# EAGLE design DCDC1 (EAGLE 7.2.0)
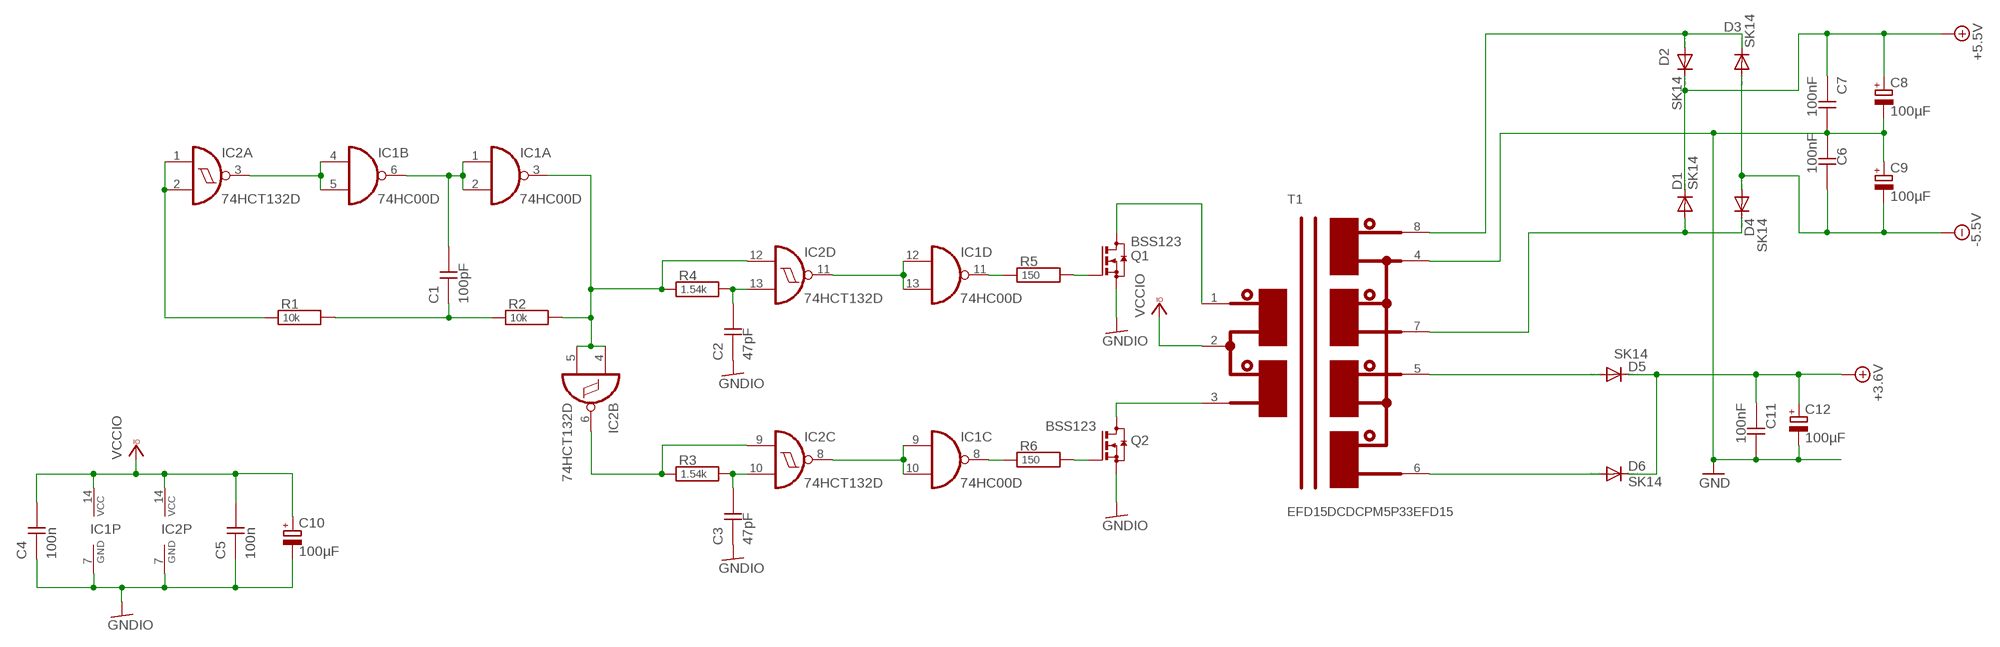
[diagram p0: schematic, sheet 1]

## Parts
C1  100pF  C0603  [0603]
C2  47pF  C0603  [0603]
C3  47pF  C0603  [0603]
C4  100n  C0603  [0603]
C5  100n  C0603  [0603]
C6  100nF  C0603  [0603]
C7  100nF  C0603  [0603]
C8  100µF  CPOL-EUCT6032  [CT6032]
C9  100µF  CPOL-EUCT6032  [CT6032]
C10  100µF  CPOL-EUCT6032  [CT6032]
C11  100nF  C0603  [0603]
C12  100µF  CPOL-EUCT6032  [CT6032]
D1  SK14  DIODE-DO214AC  [DO214AC]
D2  SK14  DIODE-DO214AC  [DO214AC]
D3  SK14  DIODE-DO214AC  [DO214AC]
D4  SK14  DIODE-DO214AC  [DO214AC]
D5  SK14  DIODE-DO214AC  [DO214AC]
D6  SK14  DIODE-DO214AC  [DO214AC]
IC1  74HC00D  [SO14]
IC2  74HCT132D  [SO14]
Q1  BSS123  [SOT23]
Q2  BSS123  [SOT23]
R1  10k  R0603  [0603]
R2  10k  R0603  [0603]
R3  1.54k  R0603  [0603]
R4  1.54k  R0603  [0603]
R5  150  R0603  [0603]
R6  150  R0603  [0603]
T1  EFD15DCDCPM5P33EFD15  [B66414-W1008-D1]

## Nets
+3.6V: C11.1 C12.+ D5.C D6.C
+5.5V: C7.1 C8.+ D1.C D2.C
-5.5V: C6.2 C9.- D3.A D4.A
GND: C6.1 C7.2 C8.- C9.+ C11.2 C12.- T1.4(SM)
GNDIO: C2.1 C3.1 C4.1 C5.1 C10.- IC1.7(P:GND) IC2.7(P:GND) Q1.2(S) Q2.2(S)
N$1: IC2.1(A:I0) IC2.2(A:I1) R1.1
N$2: IC1.4(B:I0) IC1.5(B:I1) IC2.3(A:O)
N$3: C1.1 R1.2 R2.1
N$4: C1.2 IC1.1(A:I0) IC1.2(A:I1) IC1.6(B:O)
N$5: IC1.3(A:O) IC2.4(B:I0) IC2.5(B:I1) IC2.12(D:I0) R2.2 R4.1
N$6: IC1.12(D:I0) IC1.13(D:I1) IC2.11(D:O)
N$7: C2.2 IC2.13(D:I1) R4.2
N$8: IC2.6(B:O) IC2.9(C:I0) R3.1
N$9: C3.2 IC2.10(C:I1) R3.2
N$10: IC1.9(C:I0) IC1.10(C:I1) IC2.8(C:O)
N$11: IC1.11(D:O) R5.1
N$12: IC1.8(C:O) R6.1
N$13: Q2.1(G) R6.2
N$14: D5.A T1.5(S2P)
N$15: Q1.1(G) R5.2
N$16: Q1.3(D) T1.1(P1P)
N$17: D1.A D4.C T1.7(S1N)
N$20: D2.A D3.C T1.8(S1P)
N$21: Q2.3(D) T1.3(P1N)
N$24: D6.A T1.6(S2N)
VCCIO: C4.2 C5.2 C10.+ IC1.14(P:VCC) IC2.14(P:VCC) T1.2(P1M)

## Library data of the parts
C1-C7 C11 = teg2:C0603
C8-C10 C12 = rcl:CPOL-EU: POLARIZED CAPACITOR, European symbol
D1-D6 = diode:DIODE-: DIODE
IC1 = 74xx-eu:74*00: Quad 2-input NAND gate
IC2 = 74xx-eu:74*132: Quad 2-input NAND schmitt trigger
Q1 Q2 = transistor-small-signal:BSS123: N-CHANNEL MOS FET
R1-R6 = teg2:R0603
T1 = transformers:EFD15DCDCPM5P33

## Board
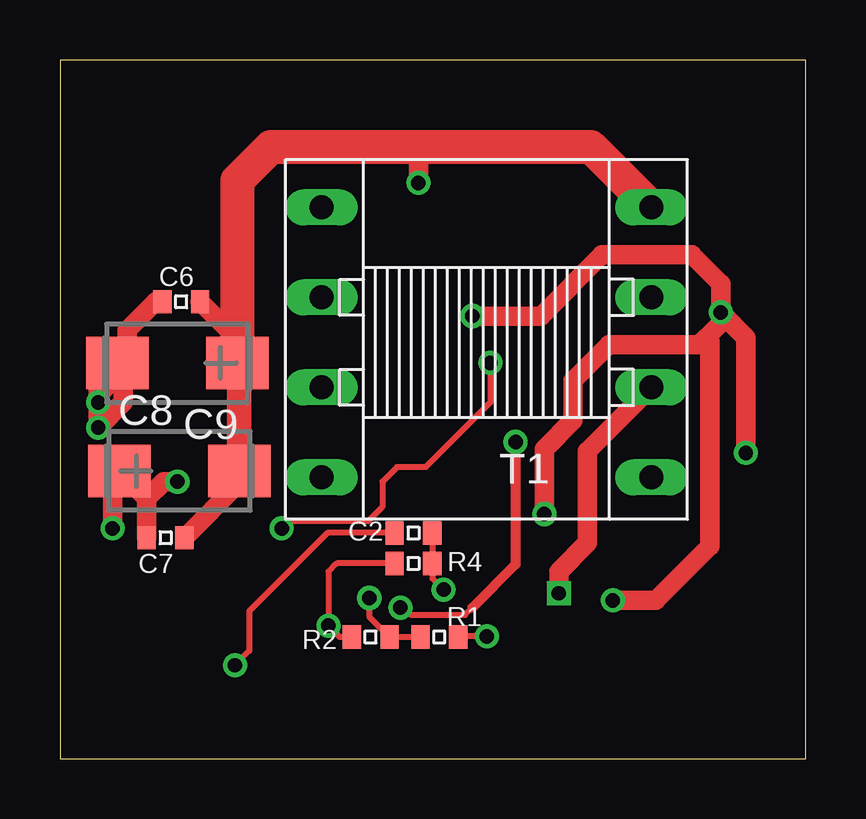
[diagram p1: board, top side]
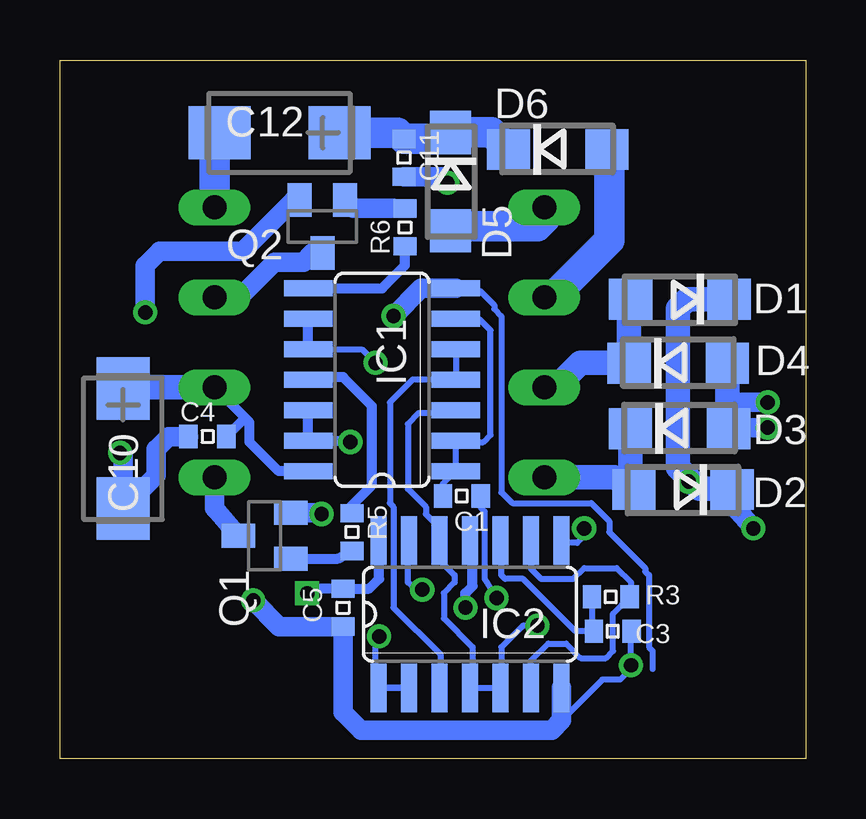
[diagram p2: board, bottom side, seen from below]

Size 31.1 x 29.11 mm. Coordinates in mm from the lower left corner, seen from the top.
Outline: 0,0 31.1,0 31.1,29.11 0,29.11 0,0
Copper layers (1*16): Top 0.035mm / dielectric 1.5mm / Bottom 0.035mm
Design rules "default *": minimum track width 10mil, minimum drill 0.3mm, track to track 6mil, track to pad 6mil, pad to pad 6mil, via to via 6mil, smd to smd 0mil, copper to edge 20mil, drill to drill 8mil, minimum pad ring 10mil, minimum via ring 8mil, stop-mask expansion 4mil, vias tented up to drill 0mil, thermal gap 10mil

### Footprints (pad centres in the part's own frame; a part is rotated, then mirrored left to right if it is on the bottom)
0603 = smd 0.762 x 0.965: 1 -0.787,0; 2 0.787,0
CT6032 = smd 2.6 x 2.2: + -2.5,0; - 2.5,0
DO214AC = smd 1.8 x 1.7: A 2.05,0; C -2.05,0
SO14 = smd 0.66 x 2.032: 1 -3.81,-3.073; 2 -2.54,-3.073; 3 -1.27,-3.073; 4 0,-3.073; 5 1.27,-3.073; 6 2.54,-3.073; 7 3.81,-3.073; 8 3.81,3.073; 9 2.54,3.073; 10 1.27,3.073; 11 0,3.073; 12 -1.27,3.073; 13 -2.54,3.073; 14 -3.81,3.073
SOT23 = smd 1 x 1.4: 1 -0.95,-1.1; 2 0.95,-1.1; 3 0,1.1
B66414-W1008-D1 = drill 1 long: 1 -3.75,0; 2 0,0; 3 3.75,0; 4 7.5,0; 5 7.5,13.75; 6 3.75,13.75; 7 0,13.75; 8 -3.75,13.75

### Placement (x,y rotation side)
C1  14.34,10.95 180 bottom
C2  14.74,9.4 0 top
C3  8.05,5.31 180 bottom
C4  24.95,13.42 0 bottom
C5  19.3,6.29 90 bottom
C6  5.06,19.04 180 top
C7  4.41,9.2 0 top
C8  4.98,11.99 0 top
C9  4.9,16.48 180 top
C10  28.47,12.93 270 bottom
C11  16.76,25.04 270 bottom
C12  21.94,26.08 180 bottom
D1  5.26,19.15 180 bottom
D2  5.13,11.22 180 bottom
D3  5.27,13.75 0 bottom
D4  5.33,16.48 0 bottom
D5  14.82,24.05 270 bottom
D6  10.35,25.38 0 bottom
IC1  17.67,15.79 90 bottom
IC2  14.01,6.02 0 bottom
Q1  22.57,9.29 90 bottom
Q2  20.16,22.18 180 bottom
R1  15.82,5.07 180 top
R2  12.96,5.07 180 top
R3  8.14,6.74 180 bottom
R4  14.74,8.13 0 top
R5  18.93,9.44 270 bottom
R6  16.72,22.14 90 bottom
T1  24.66,15.47 90 top

### Tracks (layer width: path | path; a pad name or v marks a point on that pad's centre or on a via)
+3.6V
  Bottom 1.27: C12.+ 17.02,26.08 C11.1 15.09,25.82 D5.C 13.11,26.09 D6.C
+5.5V  (via drill 0.6)
  Top 0.813: C7.1 3.62,10.85 | 3.62,10.85 C8.+ 2.2,11.7 v2.2,9.59 | v4.9,11.54 4.32,11.54 3.62,10.85
  Bottom 0.813: 3.1,11.24 3.1,10.65 v2.2,9.59
  Bottom 1.016: D1.C 4.94,19.15 5.35,18.74 5.35,12.14 4.45,11.24 3.1,11.24 D2.C
-5.5V  (via drill 0.6)
  Top 0.813: C6.2 3.99,19.04 2.8,17.84 2.8,17.39 2.65,17.24 2.65,16.2 | 2.65,16.2 1.6,15.14 v1.6,14.84 | 2.65,16.2 2.65,14.84 v1.6,13.8 v1.6,14.84 | v1.6,14.84 1.6,15.89 1.81,15.89 C9.-
  Bottom 0.813: v1.6,14.84 3.28,14.84 | v1.6,13.8 3.18,13.8 D3.A
  Bottom 1.016: D4.A 3.28,14.84 3.28,13.8 D3.A
GND  (via drill 0.6)
  Top 0.813: C9.+ 7.4,17.49 C6.1 | C8.- 7.48,11.49 C7.2 | v14.95,23.99 14.95,25.34 15.09,25.49
  Top 1.016: C8.- 7.48,16.41 C9.+
  Top 1.422: 7.4,17.49 7.4,24.1 8.8,25.49 15.09,25.49 22.14,25.49 T1.4
  Bottom 0.813: C11.2 15.2,24.25 v14.95,23.99
  Bottom 1.27: T1.4 24.66,25.87 C12.-
GNDIO  (via drill 0.6)
  Top 0.254: C2.1 11.16,9.4 7.9,6.14 7.9,4.49 v7.3,3.89
  Top 0.813: v20.2,10.2 20.2,12.89 21.4,14.09 21.4,15.74 22.9,17.24 26.65,17.24 26.95,17.55 | 26.95,17.55 27.55,18.14 v27.55,18.59 | v23.05,6.59 24.84,6.59 27.09,8.84 27.09,17.39 26.95,17.55 | v28.59,12.74 28.59,17.55 v27.55,18.59 | v17.2,18.45 20.05,18.45 22.59,20.99 26.34,20.99 27.55,19.8 v27.55,18.59
  Bottom 0.254: IC1.7 14.15,19.6 13.6,19.49 13,18.89 13,18.74 12.7,18.45 12.7,11.09 12.25,10.64 8.95,10.64 8.2,9.89 8.2,9.45 6.7,7.95 6.7,7.79 6.55,7.64 6.55,4.64 6.4,4.49 6.4,3.74 | C3.1 7.3,5.28 v7.3,3.89 7.3,3.74 7.75,3.29 8.5,3.29 10.6,1.2
  Bottom 0.813: C4.1 26.57,13.42 27.09,12.89 27.09,11.8 C10.- 28.47,12.62 v28.59,12.74 | Q1.2 20.24,10.24 v20.2,10.2 | Q2.2 21.36,23.28 23.5,21.14 26.95,21.14 27.55,20.55 v27.55,18.59 | IC2.7 10.2,1.59 10.6,1.2 18.55,1.2 19.3,1.95 C5.1 21.96,5.51 v23.05,6.59 | IC1.7 16.04,19.6 v17.2,18.45
N$1  (via drill 0.6)
  Top 0.254: v17.8,5.09 16.63,5.09 R1.1
  Bottom 0.254: IC2.1 IC2.2 17.6,2.95 17.95,3.29 17.95,4.95 v17.8,5.09
N$2
  Bottom 0.254: IC1.5 IC1.4 16.4,15.79 17.34,14.84 17.34,10.64 17.2,10.49 17.2,6.29 15.25,4.34 15.25,2.98 IC2.3
N$3  (via drill 0.6)
  Top 0.254: v12.9,6.7 12.9,5.91 R2.1 R1.2
  Bottom 0.254: C1.1 13.56,10.46 13.4,10.29 13.4,7.49 v12.9,6.7
N$4
  Bottom 0.254: IC1.6 14.56,18.3 13.6,18.3 13.15,17.84 13.15,13.49 13.45,13.2 14.54,13.2 IC1.2 IC1.1 15.13,11.45 C1.2
N$5  (via drill 0.6)
  Top 0.254: R2.2 11.67,5.07 v11.2,5.54 11.2,7.79 11.54,8.13 R4.1
  Bottom 0.254: 14.72,14.39 16.15,14.39 16.59,13.95 16.59,11.24 15.84,10.49 15.84,10.2 15.4,9.74 15.4,9.21 IC2.12 15.28,8.28 14.65,7.64 14.65,7.34 15.09,6.89 15.09,5.84 13.9,4.64 13.9,3.06 IC2.4 IC2.5 12.7,2.99 12.7,4.64 11.8,5.54 v11.2,5.54
  Bottom 0.406: 14.72,14.39 IC1.3
N$6  (via drill 0.6)
  Top 0.254: v14.2,6.29 14.34,6.29 14.65,5.99 16.9,5.99 17.2,6.29
  Top 0.406: v19,13.2 19,8.09 17.2,6.29
  Bottom 0.406: IC1.12 IC1.13 19.05,13.25 v19,13.2 | v14.2,6.29 14.2,6.89 13.9,7.2 13.9,8.98 IC2.11
N$7  (via drill 0.6)
  Top 0.254: C2.2 R4.2 15.52,7.52 v16,7.04
  Bottom 0.254: v16,7.04 16.3,7.04 16.59,7.34 16.59,9.05 IC2.13
N$8
  Bottom 0.254: IC2.9 11.47,7.92 11.05,7.49 9.7,7.49 9.25,7.95 7.9,7.95 7.3,7.34 7.3,6.8 R3.1 8.05,6.05 8.05,4.49 8.35,4.2 9.4,4.2 10,4.79 10.75,4.79 11.47,4.07 IC2.6
N$9
  Bottom 0.254: R3.2 8.93,5.4 C3.2 9.61,5.31 11.8,7.49 12.55,7.49 12.7,7.64 12.7,9.05 IC2.10
N$10  (via drill 0.6)
  Top 0.254: v17.95,16.49 17.95,14.84 15.25,12.14 14.05,12.14 13.45,11.54 13.45,10.49 12.85,9.89 9.55,9.89 v9.25,9.59
  Bottom 0.254: IC1.10 18.51,17.06 v17.95,16.49 | v9.25,9.59 9.25,9.29 9.55,8.99 10.1,8.99 IC2.8
  Bottom 0.406: IC1.10 IC1.9
N$11
  Bottom 0.406: R5.1 19.08,10.11 19,10.2 19,10.49 18.09,11.39 18.09,14.7 19.3,15.89 20.64,15.89 IC1.11
N$12
  Bottom 0.406: IC1.8 17.67,19.6 16.72,20.55 R6.1
N$13
  Bottom 0.406: R6.2 17.2,22.93
  Bottom 0.813: 17.2,22.93 18.86,22.93 Q2.1
N$14
  Bottom 1.27: T1.5 10.91,22.48 11.2,22.2 14.62,22.2 D5.A
N$15
  Bottom 0.406: Q1.1 19.51,8.34 R5.2
N$16
  Bottom 0.813: T1.1 24.66,10.43 Q1.3
N$17
  Bottom 1.016: T1.7 10.42,15.47 9.4,16.49 7.54,16.49 D4.C 7.38,19.08 D1.A
N$20
  Bottom 1.016: T1.8 7.98,11.72 D2.A 7.32,11.22 D3.C
N$21
  Bottom 0.813: 24.55,19.22 T1.3 24.63,19.2 23.65,19.2 22.15,20.7 20.95,20.7 20.56,21.08 Q2.3
N$24
  Bottom 1.27: T1.6 10.57,19.22 8.2,21.59 8.2,25.28 D6.A
VCCIO  (via drill 0.6)
  Top 0.813: v20.8,6.89 20.8,7.79 22,8.99 22,12.81 T1.2
  Bottom 0.406: IC1.14 21.98,11.98 23.2,13.2 23.2,14.01 23.39,14.2 | 28.43,15.47 C10.+ | v20.8,6.89 20.61,7.08 C5.2 18.21,7.08 17.8,7.49 17.8,9.07 IC2.14 | 23.39,14.2 T1.2 | C4.2 23.39,14.2
  Bottom 1.016: 28.43,15.47 T1.2